# EAGLE design BreadBoardPS-882 (EAGLE 7.2.0)
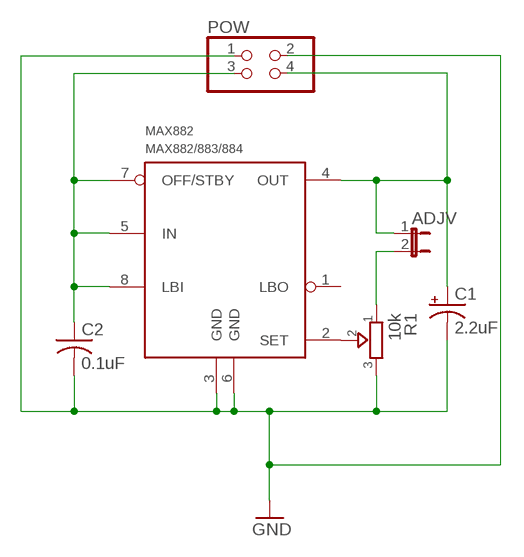
[diagram p0: schematic, sheet 1]

## Parts
ADJV  JP1E  [JP1]
C1  2.2uF  CPOL-USE2.5-5  [E2,5-5]
C2  0.1uF  C-US025-024X044  [C025-024X044]
MAX882  MAX882/883/884  [DIL08]
POW  PINHD-2X22X02/90NOSILK  [2X02/90]
R1  10k  TRIMMER-3306F  [TRIMMER_3306F]

## Nets
GND: C1.- C2.2 MAX882.3(GND) MAX882.6(GND) POW.1 POW.2 R1.3
N$1: C2.1 MAX882.5(IN) MAX882.7(OFF/STBY) MAX882.8(LBI) POW.3
N$3: ADJV.2 R1.1
N$4: ADJV.1 C1.+ MAX882.4(OUT) POW.4
N$5: MAX882.2(SET) R1.2
Unconnected: MAX882.1(LBO)

## Library data of the parts
ADJV = jumper:JP1E: JUMPER
C1 = rcl:CPOL-US: POLARIZED CAPACITOR, American symbol
C2 = resistor:C-US: CAPACITOR, American symbol
MAX882 = max882_883_884:MAX882/883/884
POW = pinhead:PINHD-2X2: PIN HEADER
R1 = dp_devices:TRIMMER: Trimmer resistor

## Board
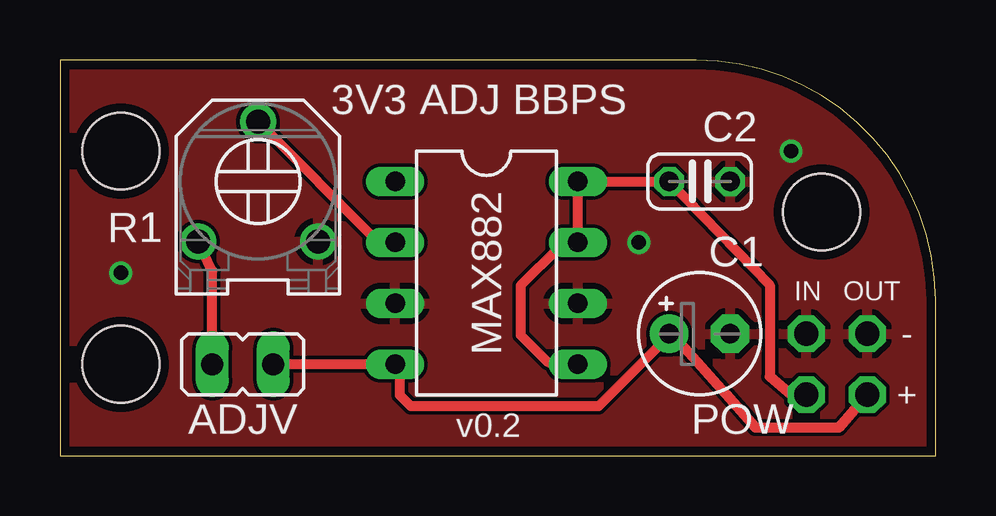
[diagram p1: board, top side]
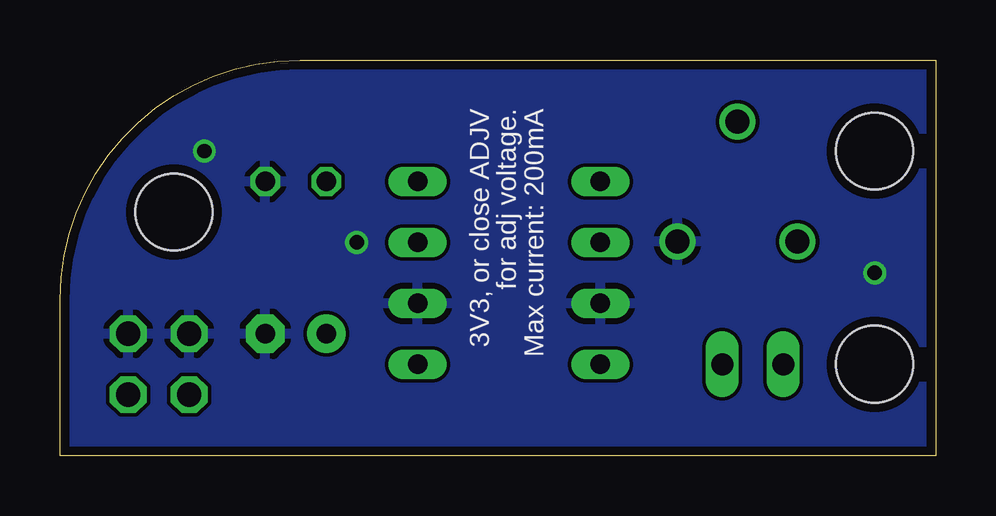
[diagram p2: board, bottom side, seen from below]

Size 36.5 x 16.5 mm. Coordinates in mm from the lower left corner, seen from the top.
Outline: 0,0 36.5,0 36.5,6.5 arc90 26.5,16.5 0,16.5 0,0
Copper layers (1*16): Top 0.0356mm / dielectric 1.5011mm / Bottom 0.0356mm
Design rules "LaenPCBOrder": minimum track width 6mil, minimum drill 13mil, track to track 6mil, track to pad 6mil, pad to pad 6mil, via to via 6mil, smd to smd 6mil, copper to edge 15mil, drill to drill 6mil, minimum pad ring 7mil, minimum via ring 7mil, stop-mask expansion 3mil, vias tented up to drill 0mil, thermal gap 10mil
Holes 3.2 mm at 2.54,12.7 2.54,3.81 31.75,10.16

### Footprints (pad centres in the part's own frame; a part is rotated, then mirrored left to right if it is on the bottom)
JP1 = drill 0.914 long: 1 0,-1.27; 2 0,1.27
E2,5-5 = drill 0.813 pad 1.6: + -1.27,0 | drill 0.813 pad 1.6 octagon: - 1.27,0
C025-024X044 = drill 0.813 octagon: 1 -1.27,0; 2 1.27,0
DIL08 = drill 0.813 long: 1 -3.81,-3.81; 2 -1.27,-3.81; 3 1.27,-3.81; 4 3.81,-3.81; 5 3.81,3.81; 6 1.27,3.81; 7 -1.27,3.81; 8 -3.81,3.81
2X02/90 = drill 1.016 octagon: 1 -1.27,-6.35; 2 -1.27,-3.81; 3 1.27,-6.35; 4 1.27,-3.81
TRIMMER_3306F = drill 1: 1 -2.5,-2.5; 2 0,2.5; 3 2.5,-2.5

### Placement (x,y rotation side)
ADJV  7.62,3.81 90 top
C1  26.67,5.08 0 top
C2  26.67,11.43 0 top
MAX882  17.78,7.62 270 top
POW  37.47,3.81 270 top
R1  8.26,11.43 0 top

### Tracks (layer width: path | path; a pad name or v marks a point on that pad's centre or on a via)
GND  (via drill 0.6)
  other vias: 2.54,7.62 30.48,12.7 24.13,8.89
  pour Top: -1.27,17.78 -1.27,-1.27 41.91,-1.27 41.91,17.78
  pour Bottom: -1.27,17.78 -1.27,-1.27 41.91,-1.27 41.91,17.78
N$1
  Top 0.254: 21.49,3.89 MAX882.5
  Top 0.406: 21.49,3.89 20.34,3.89 19.2,5.03 19.2,7.09 20.8,8.69 21.39,8.69 MAX882.7 MAX882.8 C2.1 29.59,7.11 29.59,3.3 30.48,2.54 POW.3
  Bottom 0.254: 24.92,11.43 C2.1
N$3
  Top 0.406: ADJV.2 6.35,7.7 R1.1
N$4
  Top 0.254: 25.38,5.26 C1.+ 25.38,5.03 | 14.17,3.66 MAX882.4
  Top 0.406: 25.38,5.26 27.76,2.56 28.98,1.17 32.49,1.17 POW.4 | 14.17,3.66 14.17,2.52 14.63,2.06 22.45,2.06 24.87,4.47 25.38,5.03 | MAX882.4 ADJV.1
N$5
  Top 0.254: 7.77,13.95 8.23,13.95 | 13.95,8.91 MAX882.2
  Top 0.406: 13.95,8.91 13.26,8.91 8.23,13.95 | 7.77,13.95 R1.2

### Text on the board
tNames: 3V3 ADJ BBPS | IN | OUT | - | + | v0.2
bNames: 3V3, or close ADJV / for adj voltage. / Max current: 200mA